# Altium schematic sheet circuit_2.SchDoc
size A
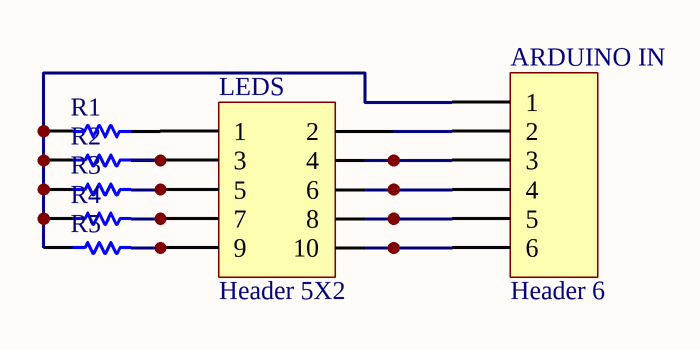
[diagram p0: circuit_2.SchDoc]

## Parts
ARDUINO_IN  Header 6  [HDR1X6]
LEDS  Header 5X2  [HDR2X5]
R1  Res1  [AXIAL-0.3]  (value not drawn)
R2  Res1  [AXIAL-0.3]  (value not drawn)
R3  Res1  [AXIAL-0.3]  (value not drawn)
R4  Res1  [AXIAL-0.3]  (value not drawn)
R5  Res1  [AXIAL-0.3]  (value not drawn)

## Nets
NetARDUINO_IN_1: ARDUINO_IN.1 R1.2 R2.1 R3.1 R4.1 R5.1
NetARDUINO_IN_2: ARDUINO_IN.2 LEDS.2
NetARDUINO_IN_3: ARDUINO_IN.3 LEDS.4
NetARDUINO_IN_4: ARDUINO_IN.4 LEDS.6
NetARDUINO_IN_5: ARDUINO_IN.5 LEDS.8
NetARDUINO_IN_6: ARDUINO_IN.6 LEDS.10
NetLEDS_1: LEDS.1 R1.1
NetLEDS_3: LEDS.3 R2.2
NetLEDS_5: LEDS.5 R3.2
NetLEDS_7: LEDS.7 R4.2
NetLEDS_9: LEDS.9 R5.2

## Library data of the parts
ARDUINO_IN = Header 6: Header, 6-Pin; LatestRevisionDate: 17-Jul-2002; LatestRevisionNote: Re-released for DXP Platform.; Publisher: Altium Limited
LEDS = Header 5X2: Header, 5-Pin, Dual row; LatestRevisionDate: 17-Jul-2002; LatestRevisionNote: Re-released for DXP Platform.; Publisher: Altium Limited
R1 = Res1: Resistor; Value: 220; Published: 8-Jun-2000; LatestRevisionDate: 17-Jul-2002; LatestRevisionNote: Re-released for DXP Platform.; PackageReference: AXIAL-0.3; Publisher: Altium Limited; PackageDescription: Axial Device, Thru-Hole; 2 Leads; 0.3 in Pin Spacing
R2-R5 = Res1: Resistor; Value: 10K; Published: 8-Jun-2000; LatestRevisionDate: 17-Jul-2002; LatestRevisionNote: Re-released for DXP Platform.; PackageReference: AXIAL-0.3; Publisher: Altium Limited; PackageDescription: Axial Device, Thru-Hole; 2 Leads; 0.3 in Pin Spacing